# EAGLE schematic 110w boost (EAGLE 7.5.0)
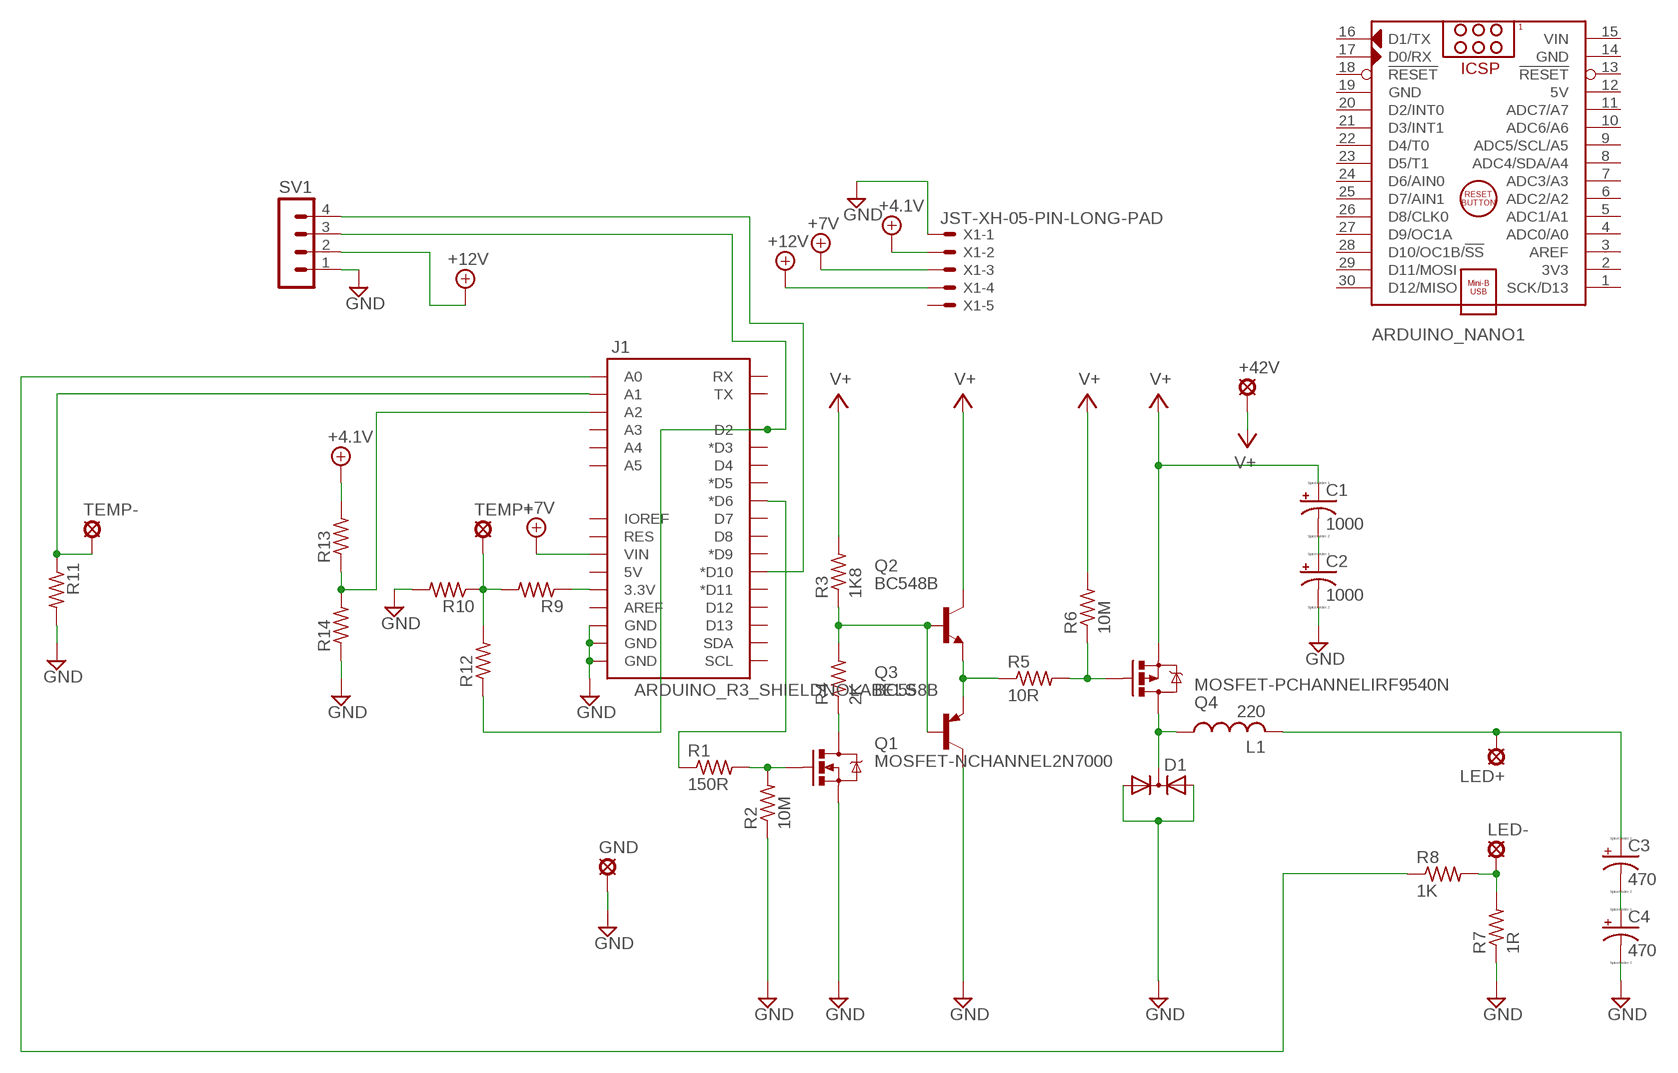
[diagram p0: schematic, sheet 1]

## Parts
+42V  SE13  [SE13]
ARDUINO_NANO1  ARDUINO_NANO  [ARDUINO_NANO]
C1  1000  CPOL-USE7.5-16  [E7,5-16]
C2  1000  CPOL-USE7.5-16  [E7,5-16]
C3  470  CPOL-USE3.5-10  [E3,5-10]
C4  470  CPOL-USE3.5-10  [E3,5-10]
D1  DIODE-2AC|CATO220V  [TO220ABS]
GND  SE13  [SE13]
J1  ARDUINO_R3_SHIELDNOLABELS  [UNO_R3_SHIELD_NOLABELS]
L1  220  L-USTJ4-U1  [TJ4-U1]
LED+  SE14  [SE14]
LED-  SE14  [SE14]
Q1  MOSFET-NCHANNEL2N7000  [TO-92]
Q2  BC548B  [TO92-EBC]
Q3  BC558B  [TO92-EBC]
Q4  MOSFET-PCHANNELIRF9540N  [TO220V]
R1  150R  R-US_0207/10  [0207/10]
R2  10M  R-US_0207/10  [0207/10]
R3  1K8  R-US_0207/10  [0207/10]
R4  2K  R-US_0207/10  [0207/10]
R5  10R  R-US_0207/10  [0207/10]
R6  10M  R-US_0207/10  [0207/10]
R7  1R  R-US_0617/22  [0617/22]
R8  1K  R-US_0207/10  [0207/10]
R9  R-US_0207/10  [0207/10]
R10  R-US_0207/10  [0207/10]
R11  R-US_0207/10  [0207/10]
R12  R-US_0207/10  [0207/10]
R13  R-US_0207/10  [0207/10]
R14  R-US_0207/10  [0207/10]
SV1  MA04-1  [MA04-1]
TEMP+  LSP11  [LSP11]
TEMP-  LSP11  [LSP11]
X1  JST-XH-05-PIN-LONG-PAD  [JST-XH-05-PACKAGE-LONG-PAD]

## Nets
+4.1V: R13.2 X1.2
+7V: J1.VIN X1.3
+12V: SV1.2 X1.4
GND [GND]: C2.- C4.- D1.A1 D1.A2 GND.MP J1.GND@0(GND) J1.GND@1(GND) J1.GND@2(GND) Q1.1(S) Q3.C R2.1 R7.1 R10.2 R11.2 R14.1 SV1.1 X1.1
N$1: J1.D6(*D6) R1.1
N$2 [Power]: D1.C L1.1 Q4.2(D)
N$3: Q1.2(G) R1.2 R2.2
N$4: Q2.B Q3.B R3.1 R4.2
N$5: Q1.3(D) R4.1
N$6: Q2.E Q3.E R5.1
N$7: Q4.1(G) R5.2 R6.1
N$8: C1.- C2.+
N$9 [Power]: C3.- C4.+
N$10 [Power]: C3.+ L1.2 LED+.MP
N$11: J1.A0 R8.1
N$12 [Power]: LED-.MP R7.2 R8.2
N$13: J1.3.3V R9.1
N$14: R9.2 R10.1 R12.2 TEMP+.MP
N$15: J1.A1 R11.1 TEMP-.MP
N$16: J1.D10(*D10) SV1.4
N$17: J1.D2 R12.1 SV1.3
N$18: J1.A2 R13.1 R14.2
V+ [Power]: +42V.MP C1.+ Q2.C Q4.3(S) R3.2 R6.2
Unconnected: ARDUINO_NANO1.1(SCK/D13) ARDUINO_NANO1.2(3V3) ARDUINO_NANO1.3(AREF) ARDUINO_NANO1.4(ADC0/A0) ARDUINO_NANO1.5(ADC1/A1) ARDUINO_NANO1.6(ADC2/A2) ARDUINO_NANO1.7(ADC3/A3) ARDUINO_NANO1.8(ADC4/SDA/A4) ARDUINO_NANO1.9(ADC5/SCL/A5) ARDUINO_NANO1.10(ADC6/A6) ARDUINO_NANO1.11(ADC7/A7) ARDUINO_NANO1.13(!RESET) ARDUINO_NANO1.16(D1/TX) ARDUINO_NANO1.17(D0/RX) ARDUINO_NANO1.18(!RESET) ARDUINO_NANO1.20(D2/INT0) ARDUINO_NANO1.21(D3/INT1) ARDUINO_NANO1.22(D4/T0) ARDUINO_NANO1.23(D5/T1) ARDUINO_NANO1.24(D6/AIN0) ARDUINO_NANO1.25(D7/AIN1) ARDUINO_NANO1.26(D8/CLK0) ARDUINO_NANO1.27(D9/OC1A) ARDUINO_NANO1.28(D10/OC1B/!SS) ARDUINO_NANO1.29(D11/MOSI) ARDUINO_NANO1.30(D12/MISO) J1.5V J1.A3 J1.A4 J1.A5 J1.AREF J1.D3(*D3) J1.D4 J1.D5(*D5) J1.D7 J1.D8 J1.D9(*D9) J1.D11(*D11) J1.D12 J1.D13 J1.IOREF J1.RES J1.RX J1.SCL J1.SDA J1.TX X1.5

## Power pins joined to a net without a drawn wire
5V: ARDUINO_NANO1.12(5V)
GND: ARDUINO_NANO1.14(GND) ARDUINO_NANO1.19(GND)
VIN: ARDUINO_NANO1.15(VIN)

## Library data of the parts
+42V GND = liam:SE13: SOLDER PAD E1542, drill 1,3mm, distributor Buerklin, 07F815
ARDUINO_NANO1 = ArduinoNanoV30:ARDUINO_NANO: Arduino Nano V3.0 Module Overview: The Arduino Nano is a small, complete, and breadboard-friendly board based on the ATmega328 (Arduino Nano 3.x) or ATmega168 (Arduino Nano 2.x). It has more or less the same functionality of the Arduino Duemilanove, but in a different package. It lacks only a DC power jack, and works with a Mini-B USB cable instead of a standard one. The Nano was designed and is being produced by Gravitech <http://www.gravitech.us/arna30wiatp.html>. General specifications: Item Value Microcontroller Atmel ATmega168 or ATmega328 Operating Voltage (logic level) 5 V Input Voltage (recommended) 7-12 V Input Voltage (limits) 6-20 V Digital I/O Pins 14 (of which 6 provide PWM output) Analog Input Pins 8 DC Current per I/O Pin 40 mA Flash Memory 16 KB (ATmega168) or 32 KB (ATmega328) of which 2 KB used by bootloader SRAM 1 KB (ATmega168) or 2 KB (ATmega328) EEPROM 512 bytes (ATmega168) or 1 KB (ATmega328) Clock Speed 16 MHz Dimensions 0.73" x 1.70" Length 45 mm Width 18 mm Weigth 5 g Power: The Arduino Nano can be powered via the Mini-B USB connection, 6-20V unregulated external power supply (pin 30), or 5V regulated external power supply (pin 27). The power source is automatically selected to the highest voltage source. Memory: The ATmega168 has 16 KB of flash memory for storing code (of which 2 KB is used for the bootloader); the ATmega328 has 32 KB, (also with 2 KB used for the bootloader). The ATmega168 has 1 KB of SRAM and 512 bytes of EEPROM (which can be read and written with the EEPROM library); the ATmega328 has 2 KB of SRAM and 1 KB of EEPROM. Input and Output: Each of the 14 digital pins on the Nano can be used as an input or output, using pinMode(), digitalWrite(), and digitalRead() functions. They operate at 5 volts. Each pin can provide or receive a maximum of 40 mA and has an internal pull-up resistor (disconnected by default) of 20-50 kOhms. In addition, some pins have specialized functions. Visit Arduino - ArduinoBoardNano <https://www.arduino.cc/en/Main/ArduinoBoardNano>
C1-C4 = liam:CPOL-US: POLARIZED CAPACITOR, American symbol
D1 = diode:DIODE-2AC|CA: Dual DIODE Anode-Cathode|Cathode-Anode
J1 = SparkFun-Boards:ARDUINO_R3_SHIELD: Shield form compatible with the Arduino Uno R3.
L1 = liam:L-US: INDUCTOR, American symbol
LED+ LED- = liam:SE14: SOLDER PAD E1553, drill 1,4mm, distributor Buerklin, 07F820
Q1 = liam:MOSFET-NCHANNEL: Common NMOSFET Parts MFG P/N Store ID Prod ID FDD8780 TRANS-09984 SI7820DN TRANS-11055 FDS6630A IC-08089 2N7002PW TRANS-11151 FQP30N06L COM-10213 TRANS-10060 BSS123LT1G TRANS-08345 BSS138 TRANS-00830 BS170 2N7000
Q2 = liam:BC548*: NPN Transistor
Q3 = liam:BC558*: PNP Transistror
Q4 = liam:MOSFET-PCHANNEL: Generic PMOSFET IRLML2244 - TRANS-11153 (SOT-23 -20V -4.3A) (1.Gate 2.Source 3.Drain) FQP27P06 - COM-10349 <http://www.sparkfun.com/products/10349> (TO-220 -60V -27A) (1.Gate 2.Source 3.Drain)
R1-R8 R11-R14 = liam:R-US_: RESISTOR, American symbol
R9 R10 = resistor:R-US_: RESISTOR, American symbol
SV1 = con-lstb:MA04-1: PIN HEADER; OC_FARNELL: unknown; OC_NEWARK: unknown
TEMP+ TEMP- = liam:LSP11: SOLDER PAD drill 1.1 mm
X1 = Rembrandt Electronics - JST XH Connectors v1-0:JST-XH-05-PIN: JST XH Connector 2 Pin Wire to board connector. Pitch: 2,54 mm, (0.100") Number of pins: 5 Created by Rembrandt Electronics www.rembrandtelectronics.com

## Net classes
0 default: width 0.5 mm, clearance 0.5 mm
1 Power: width 1.5 mm, clearance 0.205 mm to class 0, clearance 0.5 mm
2 GND: width 1.5 mm, clearance 0.205 mm to class 0, clearance 0.205 mm to class 1, clearance 0.5 mm